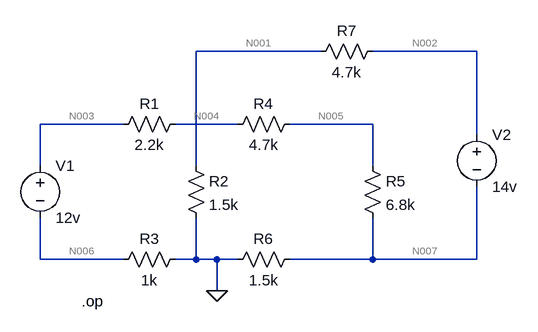
[diagram p0: schematic Draft12.asc]
Draft12.asc, the LTspice schematic file:
Version 4
SHEET 1 880 680
WIRE 416 -32 224 -32
WIRE 656 -32 496 -32
WIRE 112 80 -16 80
WIRE 288 80 192 80
WIRE 496 80 368 80
WIRE 656 96 656 -32
WIRE -16 144 -16 80
WIRE 224 144 224 -32
WIRE 496 144 496 80
WIRE -16 288 -16 224
WIRE 112 288 -16 288
WIRE 224 288 224 224
WIRE 224 288 192 288
WIRE 256 288 224 288
WIRE 288 288 256 288
WIRE 496 288 496 224
WIRE 496 288 368 288
WIRE 656 288 656 176
WIRE 656 288 496 288
WIRE 256 336 256 288
FLAG 256 336 0
SYMBOL voltage -16 128 R0
SYMATTR InstName V1
SYMATTR Value 12v
SYMBOL voltage 656 80 R0
SYMATTR InstName V2
SYMATTR Value 14v
SYMBOL res 208 64 R90
WINDOW 0 0 56 VBottom 2
WINDOW 3 32 56 VTop 2
SYMATTR InstName R1
SYMATTR Value 2.2k
SYMBOL res 96 304 R270
WINDOW 0 32 56 VTop 2
WINDOW 3 0 56 VBottom 2
SYMATTR InstName R3
SYMATTR Value 1k
SYMBOL res 272 96 R270
WINDOW 0 32 56 VTop 2
WINDOW 3 0 56 VBottom 2
SYMATTR InstName R4
SYMATTR Value 4.7k
SYMBOL res 480 128 R0
SYMATTR InstName R5
SYMATTR Value 6.8k
SYMBOL res 384 272 R90
WINDOW 0 0 56 VBottom 2
WINDOW 3 32 56 VTop 2
SYMATTR InstName R6
SYMATTR Value 1.5k
SYMBOL res 512 -48 R90
WINDOW 0 0 56 VBottom 2
WINDOW 3 32 56 VTop 2
SYMATTR InstName R7
SYMATTR Value 4.7k
SYMBOL res 208 128 R0
SYMATTR InstName R2
SYMATTR Value 1.5k
TEXT 48 352 Left 2 !.op

The netlist it stands for:
* Draft12.asc
V1 N003 N006 12v
V2 N002 N007 14v
R1 N004 N003 2.2k
R3 N006 0 1k
R4 N004 N005 4.7k
R5 N005 N007 6.8k
R6 N007 0 1.5k
R7 N002 N001 4.7k
R2 N001 0 1.5k
.op
.backanno
.end

* Results of the author's LTspice run, read from the files saved beside the schematic
* Operating Point:
*   V(n003) = 11.07 V
*   V(n006) = -925.8 mV
*   V(n002) = 12.39 V
*   V(n007) = -1.609 V
*   V(n004) = 9.037 V
*   V(n005) = 4.686 V
*   V(n001) = 2.998 V
*   I(R1) = -925.8 µA
*   I(R3) = -925.8 µA
*   I(R4) = 925.8 µA
*   I(R5) = 925.8 µA
*   I(R6) = -1.073 mA
*   I(R7) = 1.999 mA
*   I(R2) = 1.999 mA
*   I(V1) = -925.8 µA
*   I(V2) = -1.999 mA